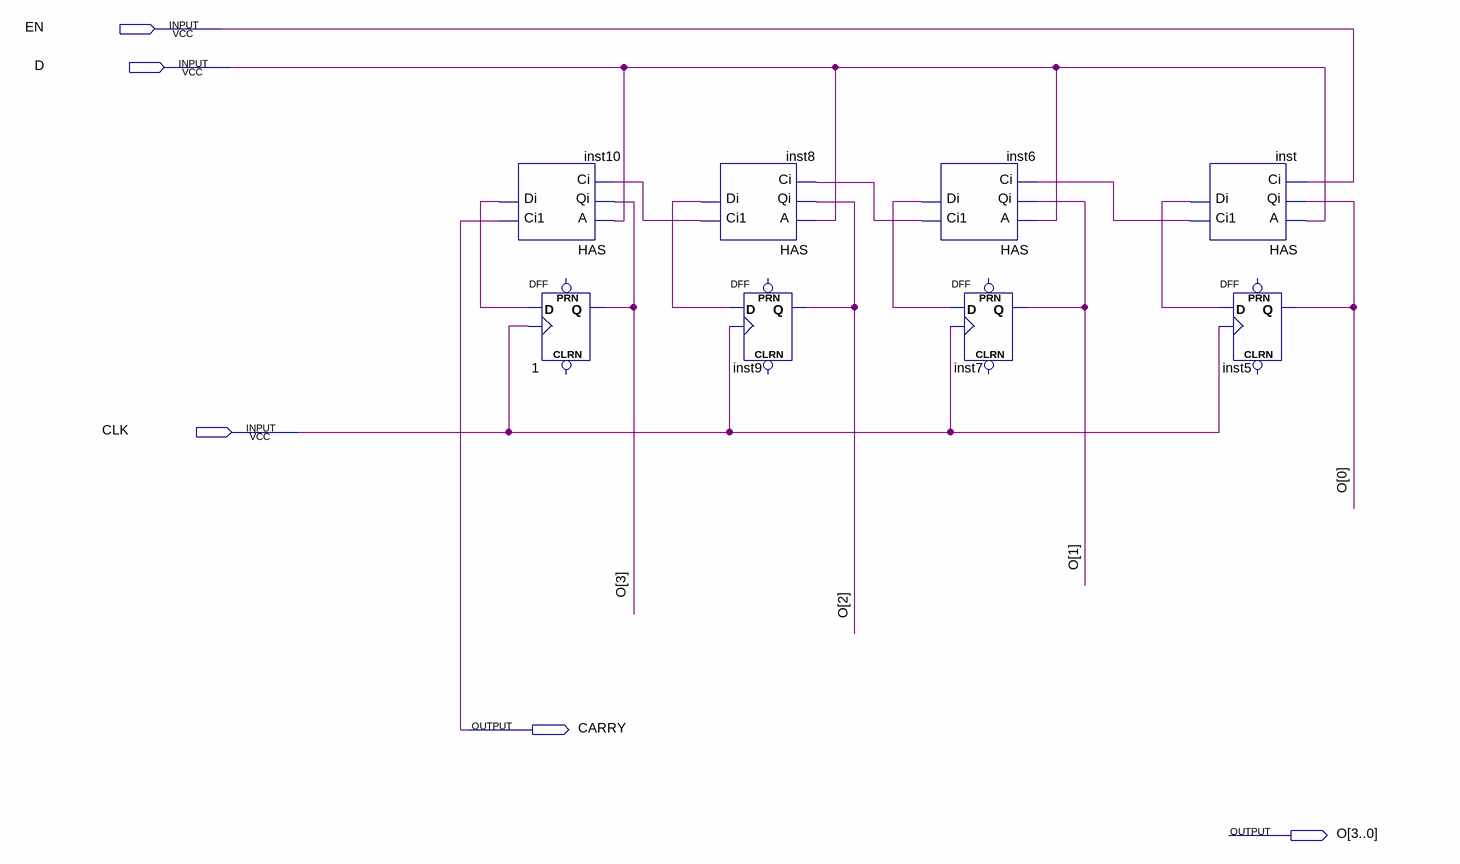
[diagram p0: schematic sheet]
// Quartus schematic UPDOWNCOUNTER3BIT.bdf as structural Verilog: 8 symbols, 5 pins
module UPDOWNCOUNTER3BIT (
  input  EN,
  input  D,
  input  CLK,
  output CARRY,
  output [3:0] O
);

  wire inst6_ci1, inst6_di, inst8_ci1, inst8_di, inst10_di, inst_ci1, inst_di;

  HAS inst10 (.A(D), .Qi(O[3]), .Ci(inst8_ci1), .Ci1(CARRY), .Di(inst10_di));
  DFF u_1 (.CLK(CLK), .D(inst10_di), .Q(O[3]));  // open: CLRN, PRN
  HAS inst8 (.A(D), .Qi(O[2]), .Ci(inst6_ci1), .Ci1(inst8_ci1), .Di(inst8_di));
  DFF inst9 (.CLK(CLK), .D(inst8_di), .Q(O[2]));  // open: CLRN, PRN
  HAS inst6 (.A(D), .Qi(O[1]), .Ci(inst_ci1), .Ci1(inst6_ci1), .Di(inst6_di));
  DFF inst7 (.CLK(CLK), .D(inst6_di), .Q(O[1]));  // open: CLRN, PRN
  HAS inst (.A(D), .Qi(O[0]), .Ci(EN), .Ci1(inst_ci1), .Di(inst_di));
  DFF inst5 (.CLK(CLK), .D(inst_di), .Q(O[0]));  // open: CLRN, PRN
endmodule
